# Altium schematic sheet FishTank.SchDoc
size A4
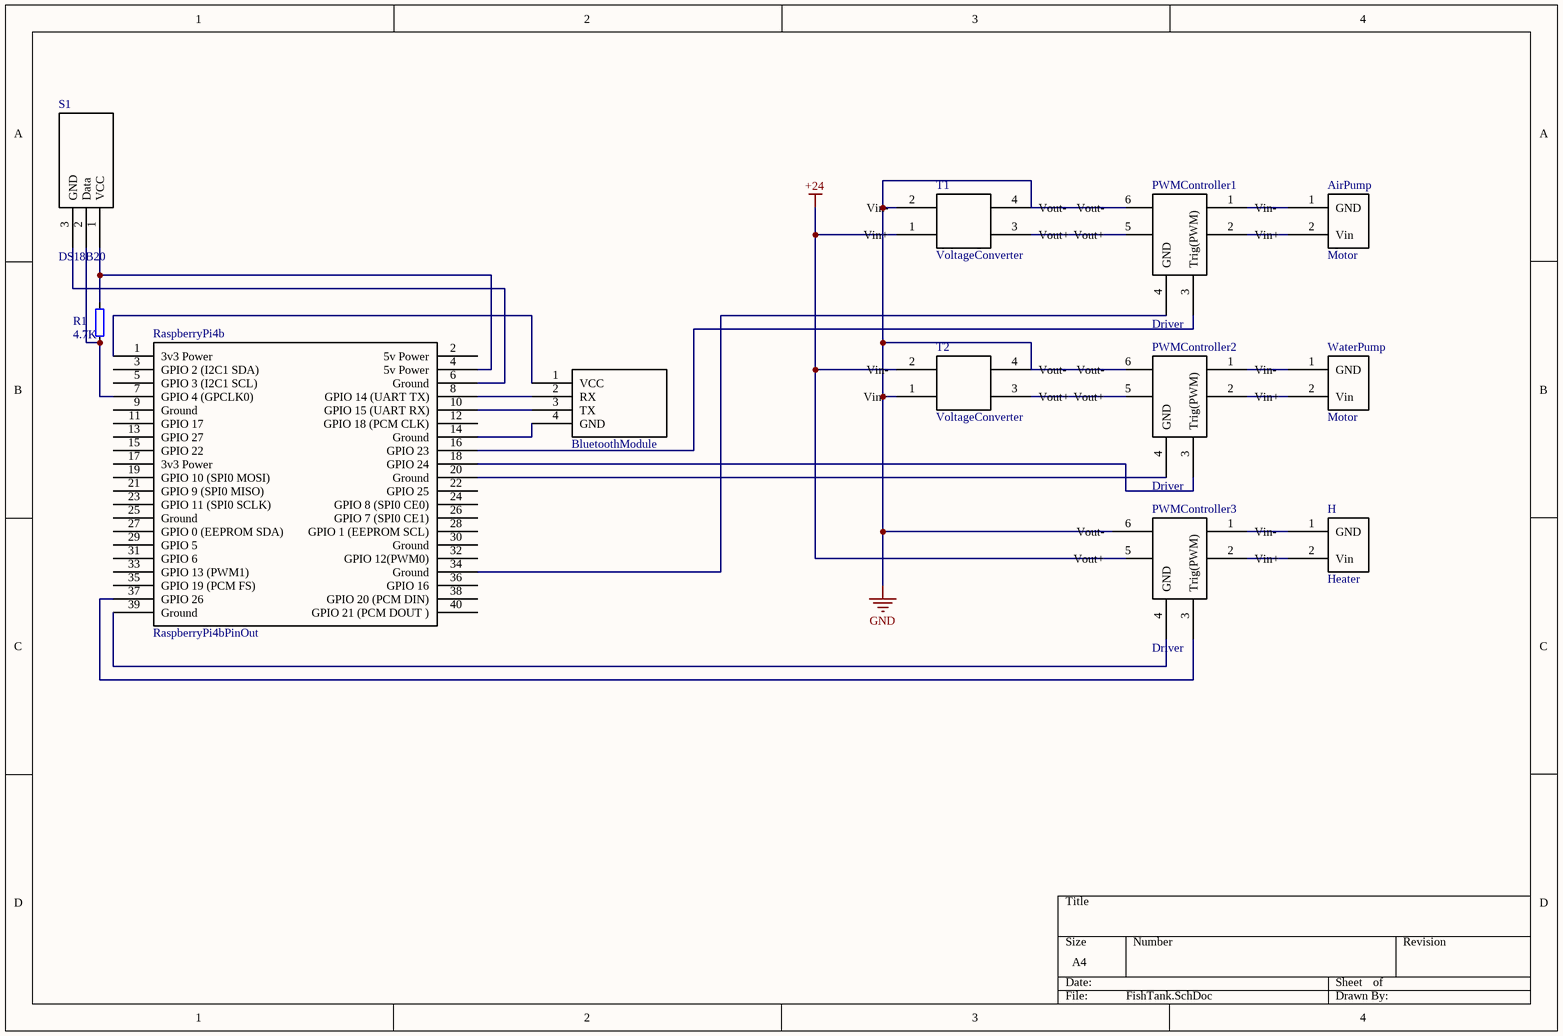
[diagram p0: FishTank.SchDoc]

## Parts
?  BluetoothModule
AirPump  Motor
H  Heater
PWMController1  Driver
PWMController2  Driver
PWMController3  Driver
R1  4.7K  [AXIAL0.3]
RaspberryPi4b  RaspberryPi4bPinOut
S1  DS18B20  [SOT-23B_N]
T1  VoltageConverter  [AXIAL-0.3]
T2  VoltageConverter  [AXIAL-0.3]
WaterPump  Motor

## Nets
Net?_1: ?.1(VCC) RaspberryPi4b.1(3v3_Power)
Net?_2: ?.2(RX) RaspberryPi4b.8(GPIO_14_(UART_TX))
Net?_3: ?.3(TX) RaspberryPi4b.10(GPIO_15_(UART_RX))
Net?_4: ?.4(GND) RaspberryPi4b.14(Ground)
NetPWMController1_3: PWMController1.3(Trig(PWM)) RaspberryPi4b.16(GPIO_23)
NetPWMController1_4: PWMController1.4(GND) RaspberryPi4b.34(Ground)
NetPWMController2_3: PWMController2.3(Trig(PWM)) RaspberryPi4b.18(GPIO_24)
NetPWMController2_4: PWMController2.4(GND) RaspberryPi4b.20(Ground)
NetPWMController3_3: PWMController3.3(Trig(PWM)) RaspberryPi4b.37(GPIO_26)
NetPWMController3_4: PWMController3.4(GND) RaspberryPi4b.39(Ground)
NetR1_1: R1.1 RaspberryPi4b.7(GPIO_4_(GPCLK0)) S1.2(Data)
NetR1_2: R1.2 RaspberryPi4b.4(5v_Power) S1.1(VCC)
NetRaspberryPi4b_6: RaspberryPi4b.6(Ground) S1.3(GND)

Not connected (* = marked no-connect by the designer): AirPump 1(GND) 2(Vin); H 1(GND) 2(Vin); PWMController1 1(Vin-) 2(Vin+) 5(Vout+) 6(Vout-); PWMController2 1(Vin-) 2(Vin+) 5(Vout+) 6(Vout-); PWMController3 1(Vin-) 2(Vin+) 5(Vout+) 6(Vout-); RaspberryPi4b 2(5v_Power) 3(GPIO_2_(I2C1_SDA)) 5(GPIO_3_(I2C1_SCL)) 9(Ground) 11(GPIO_17) 12(GPIO_18_(PCM_CLK)) 13(GPIO_27) 15(GPIO_22) 17(3v3_Power) 19(GPIO_10_(SPI0_MOSI)) 21(GPIO_9_(SPI0_MISO)) 22(GPIO_25) 23(GPIO_11_(SPI0_SCLK)) 24(GPIO_8_(SPI0_CE0)) 25(Ground) 26(GPIO_7_(SPI0_CE1)) 27(GPIO_0_(EEPROM_SDA)) 28(GPIO_1_(EEPROM_SCL)) 29(GPIO_5) 30(Ground) 31(GPIO_6) 32(GPIO_12(PWM0)) 33(GPIO_13_(PWM1)) 35(GPIO_19_(PCM_FS)) 36(GPIO_16) 38(GPIO_20_(PCM_DIN)) 40(GPIO_21_(PCM_DOUT_)); T1 1(Vin+) 2(Vin-) 3(Vout+) 4(Vout-); T2 1(Vin+) 2(Vin-) 3(Vout+) 4(Vout-); WaterPump 1(GND) 2(Vin)

## Library data of the parts
H = Motor
R1 = RES
RaspberryPi4b = RaspberryPi4b
S1 = DS18B20: Published: 8-Jun-2000; LatestRevisionDate: 29-May-2009; LatestRevisionNote: IPC-7351 Footprint Added.; PackageVersion: Aug-1999; PackageReference: SOT-23B; Publisher: Altium Limited; PackageDescription: 3-Pin SOT-23 Package 0.95 mm Pitch, 2.4 mm Lead Span
T1 T2 = VoltageConverter: Published: 8-Jun-2000; LatestRevisionDate: 17-Jul-2002; LatestRevisionNote: Re-released for DXP Platform.; PackageReference: AXIAL-0.3; Publisher: Altium Limited; PackageDescription: Axial Device, Thru-Hole; 2 Leads; 0.3 in Pin Spacing